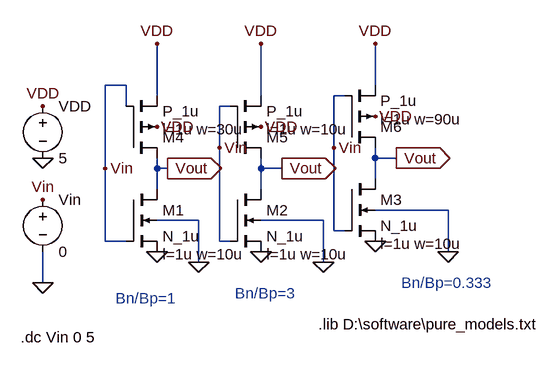
[diagram p0: schematic lab_03.asc]
lab_03.asc, the LTspice schematic file:
Version 4
SHEET 1 880 680
WIRE 80 16 48 16
WIRE 464 16 464 -48
WIRE 128 32 128 -48
WIRE 288 32 288 -48
WIRE 416 32 400 32
WIRE 80 48 80 16
WIRE 240 48 224 48
WIRE 224 112 224 48
WIRE 400 112 400 32
WIRE 464 128 464 112
WIRE 496 128 464 128
WIRE 48 144 48 16
WIRE 128 144 128 128
WIRE 144 144 128 144
WIRE 288 144 288 128
WIRE 320 144 288 144
WIRE 464 160 464 128
WIRE 128 176 128 144
WIRE 288 176 288 144
WIRE 576 208 464 208
WIRE 192 224 128 224
WIRE 384 224 288 224
WIRE 400 240 400 112
WIRE 416 240 400 240
WIRE 48 256 48 144
WIRE 80 256 48 256
WIRE 224 256 224 112
WIRE 240 256 224 256
WIRE 576 272 576 208
WIRE 192 288 192 224
WIRE 384 288 384 224
WIRE -48 320 -48 272
FLAG 144 144 Vout
IOPIN 144 144 Out
FLAG 320 144 Vout
IOPIN 320 144 Out
FLAG 496 128 Vout
IOPIN 496 128 Out
FLAG 128 272 0
FLAG 288 272 0
FLAG 464 256 0
FLAG 192 288 0
FLAG 384 288 0
FLAG 576 272 0
FLAG -48 320 0
FLAG -48 128 0
FLAG 48 144 Vin
FLAG 400 112 Vin
FLAG 224 112 Vin
FLAG 128 -48 VDD
FLAG 288 -48 VDD
FLAG 464 -48 VDD
FLAG -48 48 VDD
FLAG 128 80 VDD
FLAG 288 80 VDD
FLAG 464 64 VDD
FLAG -48 192 Vin
SYMBOL nmos4 80 176 R0
WINDOW 123 56 100 Left 2
SYMATTR InstName M1
SYMATTR Value N_1u
SYMATTR Value2 l=1u w=10u
SYMBOL nmos4 240 176 R0
WINDOW 123 56 100 Left 2
SYMATTR InstName M2
SYMATTR Value N_1u
SYMATTR Value2 l=1u w=10u
SYMBOL nmos4 416 160 R0
WINDOW 123 56 100 Left 2
SYMATTR InstName M3
SYMATTR Value N_1u
SYMATTR Value2 l=1u w=10u
SYMBOL pmos4 80 128 M180
WINDOW 123 56 44 Left 2
SYMATTR InstName M4
SYMATTR Value P_1u
SYMATTR Value2 l=1u w=30u
SYMBOL pmos4 240 128 M180
WINDOW 123 56 44 Left 2
SYMATTR InstName M5
SYMATTR Value P_1u
SYMATTR Value2 l=1u w=10u
SYMBOL pmos4 416 112 M180
WINDOW 123 56 44 Left 2
SYMATTR InstName M6
SYMATTR Value P_1u
SYMATTR Value2 l=1u w=90u
SYMBOL voltage -48 32 R0
WINDOW 123 0 0 Left 0
WINDOW 39 0 0 Left 0
SYMATTR InstName VDD
SYMATTR Value 5
SYMBOL voltage -48 176 R0
WINDOW 123 0 0 Left 0
WINDOW 39 0 0 Left 0
SYMATTR InstName Vin
SYMATTR Value 0
TEXT 376 384 Left 2 !.lib D:\\software\\pure_models.txt
TEXT -82 404 Left 2 !.dc Vin 0 5
TEXT 64 344 Left 2 ;Bn/Bp=1
TEXT 248 336 Left 2 ;Bn/Bp=3
TEXT 504 320 Left 2 ;Bn/Bp=0.333

The netlist it stands for:
* lab_03.asc
M1 Vout Vin 0 0 N_1u l=1u w=10u
M2 Vout Vin 0 0 N_1u l=1u w=10u
M3 Vout Vin 0 0 N_1u l=1u w=10u
M4 Vout Vin VDD VDD P_1u l=1u w=30u
M5 Vout Vin VDD VDD P_1u l=1u w=10u
M6 Vout Vin VDD VDD P_1u l=1u w=90u
VDD VDD 0 5
Vin Vin 0 0
.model NMOS NMOS
.model PMOS PMOS
.lib standard.mos
.lib D:\software\pure_models.txt
.dc Vin 0 5
* Bn/Bp=1
* Bn/Bp=3
* Bn/Bp=0.333
.backanno
.end

* Results of the author's LTspice run, read from the files saved beside the schematic
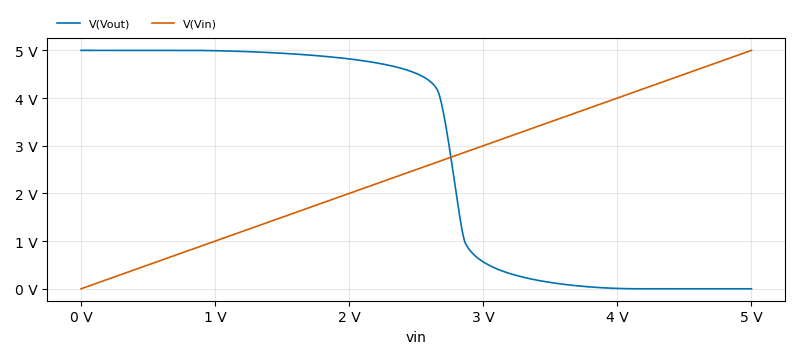
[diagram p1: DC transfer characteristic of lab_03.asc, plotted from the saved traces]
* DC transfer characteristic, 1 run:
*   V(Vout): 5 V at vin=0 V, 2.395 nV at vin=5 V, min 2.395 nV, max 5 V
*   V(Vin): 0 V at vin=0 V, 5 V at vin=5 V, min 0 V, max 5 V